# EAGLE schematic I2C header (EAGLE 8.2.1)
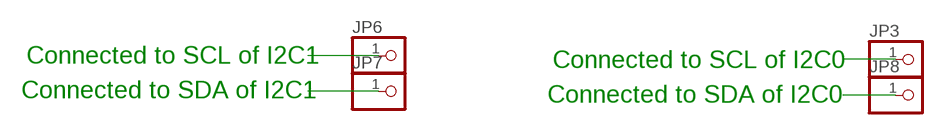
[diagram p0: schematic, sheet 1]

## Parts
JP3  PINHD-1X1  [1X01]
JP6  PINHD-1X1  [1X01]
JP7  PINHD-1X1  [1X01]
JP8  PINHD-1X1  [1X01]

## Nets
SCL: JP3.1 JP6.1
SDA: JP7.1 JP8.1

## Notes on the sheet
- Connected to SCL of I2C1 | Connected to SCL of I2C0
- Connected to SDA of I2C1 | Connected to SDA of I2C0

## Library data of the parts
JP3 JP6-JP8 = adafruit:PINHD-1X1: Pin header 1x1 for 0.1" spacing With round pins

## Net classes
0 default: width 0.2 mm, clearance 0.2 mm